# EAGLE schematic KH3-Receiver-Breakout (EAGLE 7.5.0)
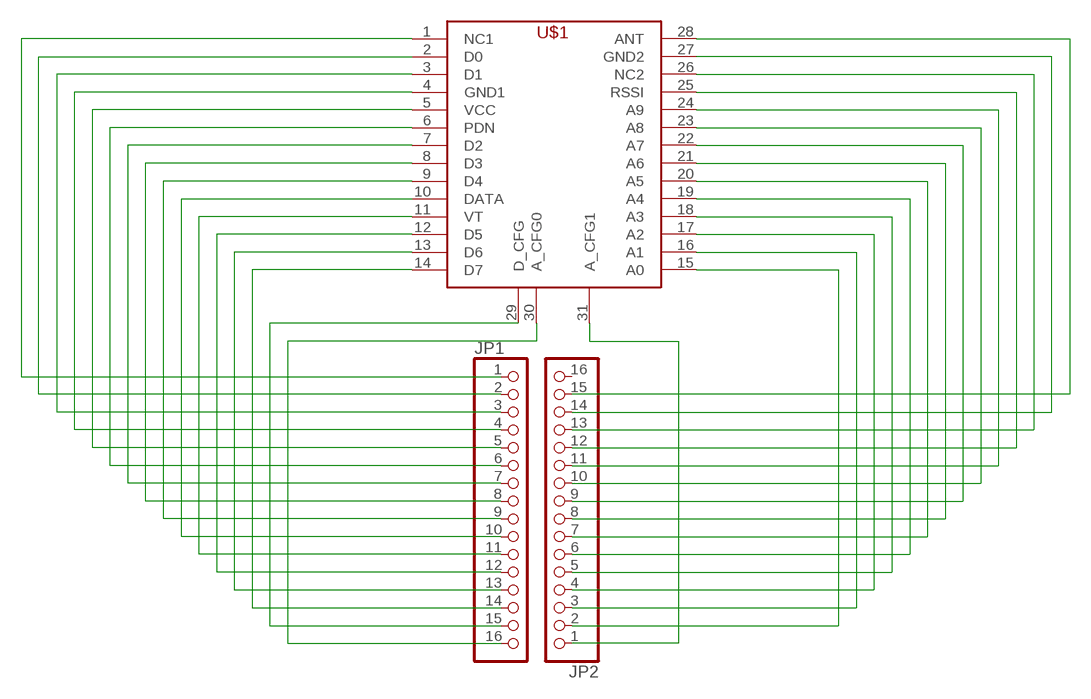
[diagram p0: schematic, sheet 1]

## Parts
JP1  PINHD-1X16  [1X16]
JP2  PINHD-1X16  [1X16]
U$1  KH3-RXM-LINX-315  [KH3-RXM-LINX-315]

## Nets
N$1: JP1.3 U$1.3(D1)
N$2: JP1.4 U$1.4(GND1)
N$3: JP1.5 U$1.5(VCC)
N$4: JP1.6 U$1.6(PDN)
N$5: JP1.7 U$1.7(D2)
N$6: JP1.8 U$1.8(D3)
N$7: JP1.9 U$1.9(D4)
N$8: JP1.10 U$1.10(DATA)
N$9: JP1.11 U$1.11(VT)
N$10: JP1.12 U$1.12(D5)
N$11: JP1.13 U$1.13(D6)
N$12: JP1.14 U$1.14(D7)
N$13: JP2.14 U$1.27(GND2)
N$14: JP1.16 U$1.30(A_CFG0)
N$15: JP2.13 U$1.26(NC2)
N$16: JP2.12 U$1.25(RSSI)
N$17: JP2.11 U$1.24(A9)
N$18: JP2.10 U$1.23(A8)
N$19: JP2.9 U$1.22(A7)
N$20: JP2.8 U$1.21(A6)
N$21: JP2.7 U$1.20(A5)
N$22: JP2.6 U$1.19(A4)
N$23: JP2.5 U$1.18(A3)
N$24: JP2.4 U$1.17(A2)
N$25: JP2.3 U$1.16(A1)
N$26: JP2.2 U$1.15(A0)
N$27: JP2.1 U$1.31(A_CFG1)
N$28: JP1.15 U$1.29(D_CFG)
N$29: JP2.15 U$1.28(ANT)
N$30: JP1.2 U$1.2(D0)
N$31: JP1.1 U$1.1(NC1)
Unconnected: JP2.16

## Library data of the parts
JP1 JP2 = pinhead:PINHD-1X16: PIN HEADER
U$1 = KH3-RXM-LINX-315:KH3-RXM-LINX-315